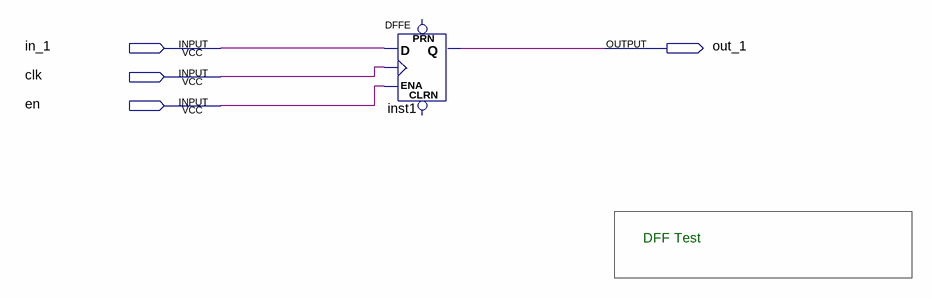
[diagram p0: schematic sheet]
// Quartus schematic ta.bdf as structural Verilog: 1 symbols, 4 pins
module ta (
  input  in_1,
  input  clk,
  input  en,
  output out_1
);

  DFFE inst1 (.D(in_1), .CLK(clk), .ENA(en), .Q(out_1));  // open: PRN, CLRN

  // Notes on the sheet:
  //   DFF Test
endmodule
